# EAGLE design stm32 (EAGLE 8.6.0)
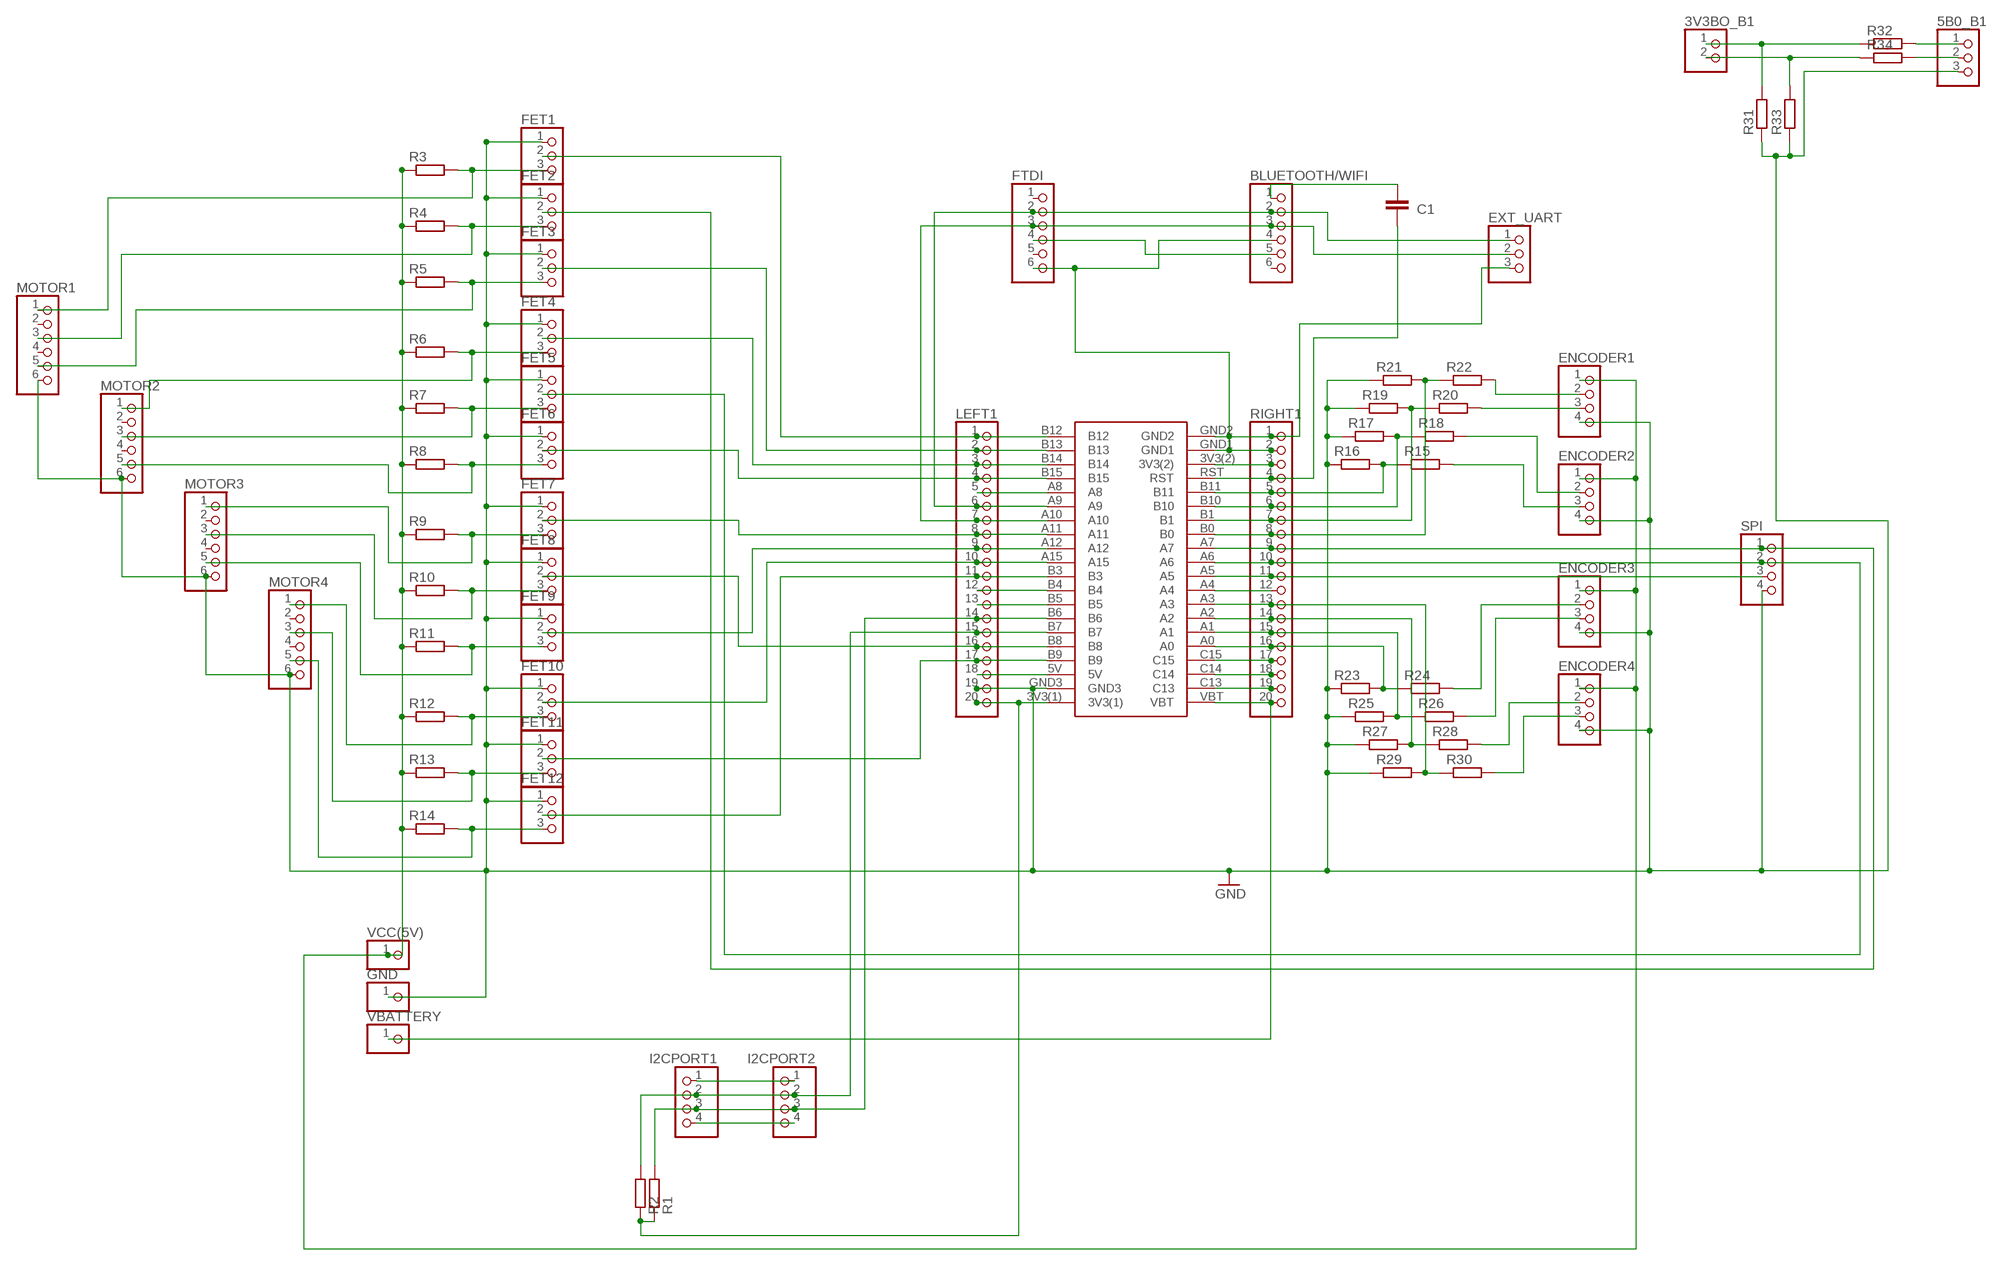
[diagram p0: schematic, sheet 1]

## Parts
3V3BO_B1  PINHD-1X2  [1X02]
5B0_B1  PINHD-1X3  [1X03]
BLUETOOTH/WIFI  PINHD-1X6  [1X06]
C1  C-EU025-030X050  [C025-030X050]
ENCODER1  PINHD-1X4  [1X04]
ENCODER2  PINHD-1X4  [1X04]
ENCODER3  PINHD-1X4  [1X04]
ENCODER4  PINHD-1X4  [1X04]
EXT_UART  PINHD-1X3  [1X03]
FET1  PINHD-1X3  [1X03]
FET2  PINHD-1X3  [1X03]
FET3  PINHD-1X3  [1X03]
FET4  PINHD-1X3  [1X03]
FET5  PINHD-1X3  [1X03]
FET6  PINHD-1X3  [1X03]
FET7  PINHD-1X3  [1X03]
FET8  PINHD-1X3  [1X03]
FET9  PINHD-1X3  [1X03]
FET10  PINHD-1X3  [1X03]
FET11  PINHD-1X3  [1X03]
FET12  PINHD-1X3  [1X03]
FTDI  PINHD-1X6  [1X06]
GND  PINHD-1X1  [1X01]
I2CPORT1  PINHD-1X4  [1X04]
I2CPORT2  PINHD-1X4  [1X04]
LEFT1  PINHD-1X20  [1X20]
MOTOR1  PINHD-1X6  [1X06]
MOTOR2  PINHD-1X6  [1X06]
MOTOR3  PINHD-1X6  [1X06]
MOTOR4  PINHD-1X6  [1X06]
R1  R-EU_0204/5  [0204/5]
R2  R-EU_0204/5  [0204/5]
R3  R-EU_0204/5  [0204/5]
R4  R-EU_0204/5  [0204/5]
R5  R-EU_0204/5  [0204/5]
R6  R-EU_0204/5  [0204/5]
R7  R-EU_0204/5  [0204/5]
R8  R-EU_0204/5  [0204/5]
R9  R-EU_0204/5  [0204/5]
R10  R-EU_0204/5  [0204/5]
R11  R-EU_0204/5  [0204/5]
R12  R-EU_0204/5  [0204/5]
R13  R-EU_0204/5  [0204/5]
R14  R-EU_0204/5  [0204/5]
R15  R-EU_0204/5  [0204/5]
R16  R-EU_0204/5  [0204/5]
R17  R-EU_0204/5  [0204/5]
R18  R-EU_0204/5  [0204/5]
R19  R-EU_0204/5  [0204/5]
R20  R-EU_0204/5  [0204/5]
R21  R-EU_0204/5  [0204/5]
R22  R-EU_0204/5  [0204/5]
R23  R-EU_0204/5  [0204/5]
R24  R-EU_0204/5  [0204/5]
R25  R-EU_0204/5  [0204/5]
R26  R-EU_0204/5  [0204/5]
R27  R-EU_0204/5  [0204/5]
R28  R-EU_0204/5  [0204/5]
R29  R-EU_0204/5  [0204/5]
R30  R-EU_0204/5  [0204/5]
R31  R-EU_0204/5  [0204/5]
R32  R-EU_0204/5  [0204/5]
R33  R-EU_0204/5  [0204/5]
R34  R-EU_0204/5  [0204/5]
RIGHT1  PINHD-1X20  [1X20]
SPI  PINHD-1X4  [1X04]
U$1  STM32THROUGH_HOLE  [STM32]
VBATTERY  PINHD-1X1  [1X01]
VCC(5V)  PINHD-1X1  [1X01]

## Nets
5V: ENCODER1.1 ENCODER2.1 ENCODER3.1 ENCODER4.1 R3.1 R4.1 R5.1 R6.1 R7.1 R8.1 R9.1 R10.1 R11.1 R12.1 R13.1 R14.1 VCC(5V).1
B0: ENCODER1.2 R22.2
B1: ENCODER1.3 R20.2
GND: 5B0_B1.3 ENCODER1.4 ENCODER2.4 ENCODER3.4 ENCODER4.4 FET1.1 FET2.1 FET3.1 FET4.1 FET5.1 FET6.1 FET7.1 FET8.1 FET9.1 FET10.1 FET11.1 FET12.1 GND.1 LEFT1.19 MOTOR1.6 MOTOR2.6 MOTOR3.6 MOTOR4.6 R16.1 R17.1 R19.1 R21.1 R23.1 R25.1 R27.1 R29.1 R31.1 R33.1 SPI.4 U$1.GND3
N$1: 3V3BO_B1.1 R31.2 R32.1
N$2: FET3.2 LEFT1.2 U$1.B13
N$3: LEFT1.20 R1.1 R2.1 U$1.3V3(1)
N$4: FET4.2 LEFT1.3 U$1.B14
N$5: FET6.2 LEFT1.4 U$1.B15
N$6: LEFT1.5 U$1.A8
N$7: BLUETOOTH/WIFI.2 EXT_UART.1 FTDI.2 LEFT1.6 U$1.A9
N$8: LEFT1.18 U$1.5V
N$9: BLUETOOTH/WIFI.3 EXT_UART.2 FTDI.3 LEFT1.7 U$1.A10
N$10: BLUETOOTH/WIFI.5 FTDI.4
N$11: FET10.2 LEFT1.10 U$1.A15
N$12: FET7.2 LEFT1.8 U$1.A11
N$13: FET9.2 LEFT1.9 U$1.A12
N$14: BLUETOOTH/WIFI.1 C1.2
N$15: FET12.2 LEFT1.11 U$1.B3
N$16: I2CPORT1.2 I2CPORT2.2 LEFT1.15 R2.2 U$1.B7
N$17: FET8.2 LEFT1.16 U$1.B8
N$18: FET11.2 LEFT1.17 U$1.B9
N$19: LEFT1.12 U$1.B4
N$20: BLUETOOTH/WIFI.4 EXT_UART.3 FTDI.6 RIGHT1.1 RIGHT1.2 U$1.GND1 U$1.GND2
N$21: 3V3BO_B1.2 R33.2 R34.1
N$22: RIGHT1.20 U$1.VBT VBATTERY.1
N$23: RIGHT1.19 U$1.C13
N$24: RIGHT1.18 U$1.C14
N$25: RIGHT1.17 U$1.C15
N$26: R23.2 R24.1 RIGHT1.16 U$1.A0
N$27: I2CPORT1.1 I2CPORT2.1
N$28: R25.2 R26.1 RIGHT1.15 U$1.A1
N$29: R27.2 R28.1 RIGHT1.14 U$1.A2
N$30: I2CPORT1.3 I2CPORT2.3 LEFT1.14 R1.2 U$1.B6
N$31: R29.2 R30.1 RIGHT1.13 U$1.A3
N$32: RIGHT1.12 U$1.A4
N$33: RIGHT1.11 SPI.3 U$1.A5
N$34: 5B0_B1.1 R32.2
N$35: FET5.2 RIGHT1.10 SPI.2 U$1.A6
N$36: 5B0_B1.2 R34.2
N$37: R21.2 R22.1 RIGHT1.8 U$1.B0
N$39: R17.2 R18.1 RIGHT1.6 U$1.B10
N$40: I2CPORT1.4 I2CPORT2.4
N$43: RIGHT1.3 U$1.3V3(2)
N$44: C1.1 RIGHT1.4 U$1.RST
N$45: R15.1 R16.2 RIGHT1.5 U$1.B11
N$46: FET1.2 LEFT1.1 U$1.B12
N$47: LEFT1.13 U$1.B5
N$48: FET1.3 MOTOR1.1 R3.2
N$49: FET2.3 MOTOR1.3 R4.2
N$50: FET3.3 MOTOR1.5 R5.2
N$51: FET4.3 MOTOR2.1 R6.2
N$52: FET5.3 MOTOR2.3 R7.2
N$53: FET6.3 MOTOR2.5 R8.2
N$54: FET7.3 MOTOR3.1 R9.2
N$55: FET8.3 MOTOR3.3 R10.2
N$56: FET9.3 MOTOR3.5 R11.2
N$57: FET11.3 MOTOR4.3 R13.2
N$58: FET10.3 MOTOR4.1 R12.2
N$59: FET12.3 MOTOR4.5 R14.2
N$60: FET2.2 RIGHT1.9 SPI.1 U$1.A7
N$63: R19.2 R20.1 RIGHT1.7 U$1.B1
N$65: ENCODER3.2 R24.2
N$66: ENCODER3.3 R26.2
N$67: ENCODER4.2 R28.2
N$68: ENCODER4.3 R30.2
N$73: ENCODER2.2 R18.2
N$74: ENCODER2.3 R15.2
Unconnected: BLUETOOTH/WIFI.6 FTDI.1 FTDI.5 MOTOR1.2 MOTOR1.4 MOTOR2.2 MOTOR2.4 MOTOR3.2 MOTOR3.4 MOTOR4.2 MOTOR4.4

## Library data of the parts
3V3BO_B1 = pinhead:PINHD-1X2: PIN HEADER
5B0_B1 EXT_UART FET1-FET12 = pinhead:PINHD-1X3: PIN HEADER
BLUETOOTH/WIFI FTDI MOTOR1-MOTOR4 = pinhead:PINHD-1X6: PIN HEADER
C1 = resistor:C-EU: CAPACITOR, European symbol
ENCODER1-ENCODER4 I2CPORT1 I2CPORT2 SPI = pinhead:PINHD-1X4: PIN HEADER
GND VBATTERY VCC(5V) = pinhead:PINHD-1X1: PIN HEADER
LEFT1 RIGHT1 = pinhead:PINHD-1X20: PIN HEADER
R1-R34 = resistor:R-EU_: RESISTOR, European symbol
U$1 = stm32:STM32

## Board
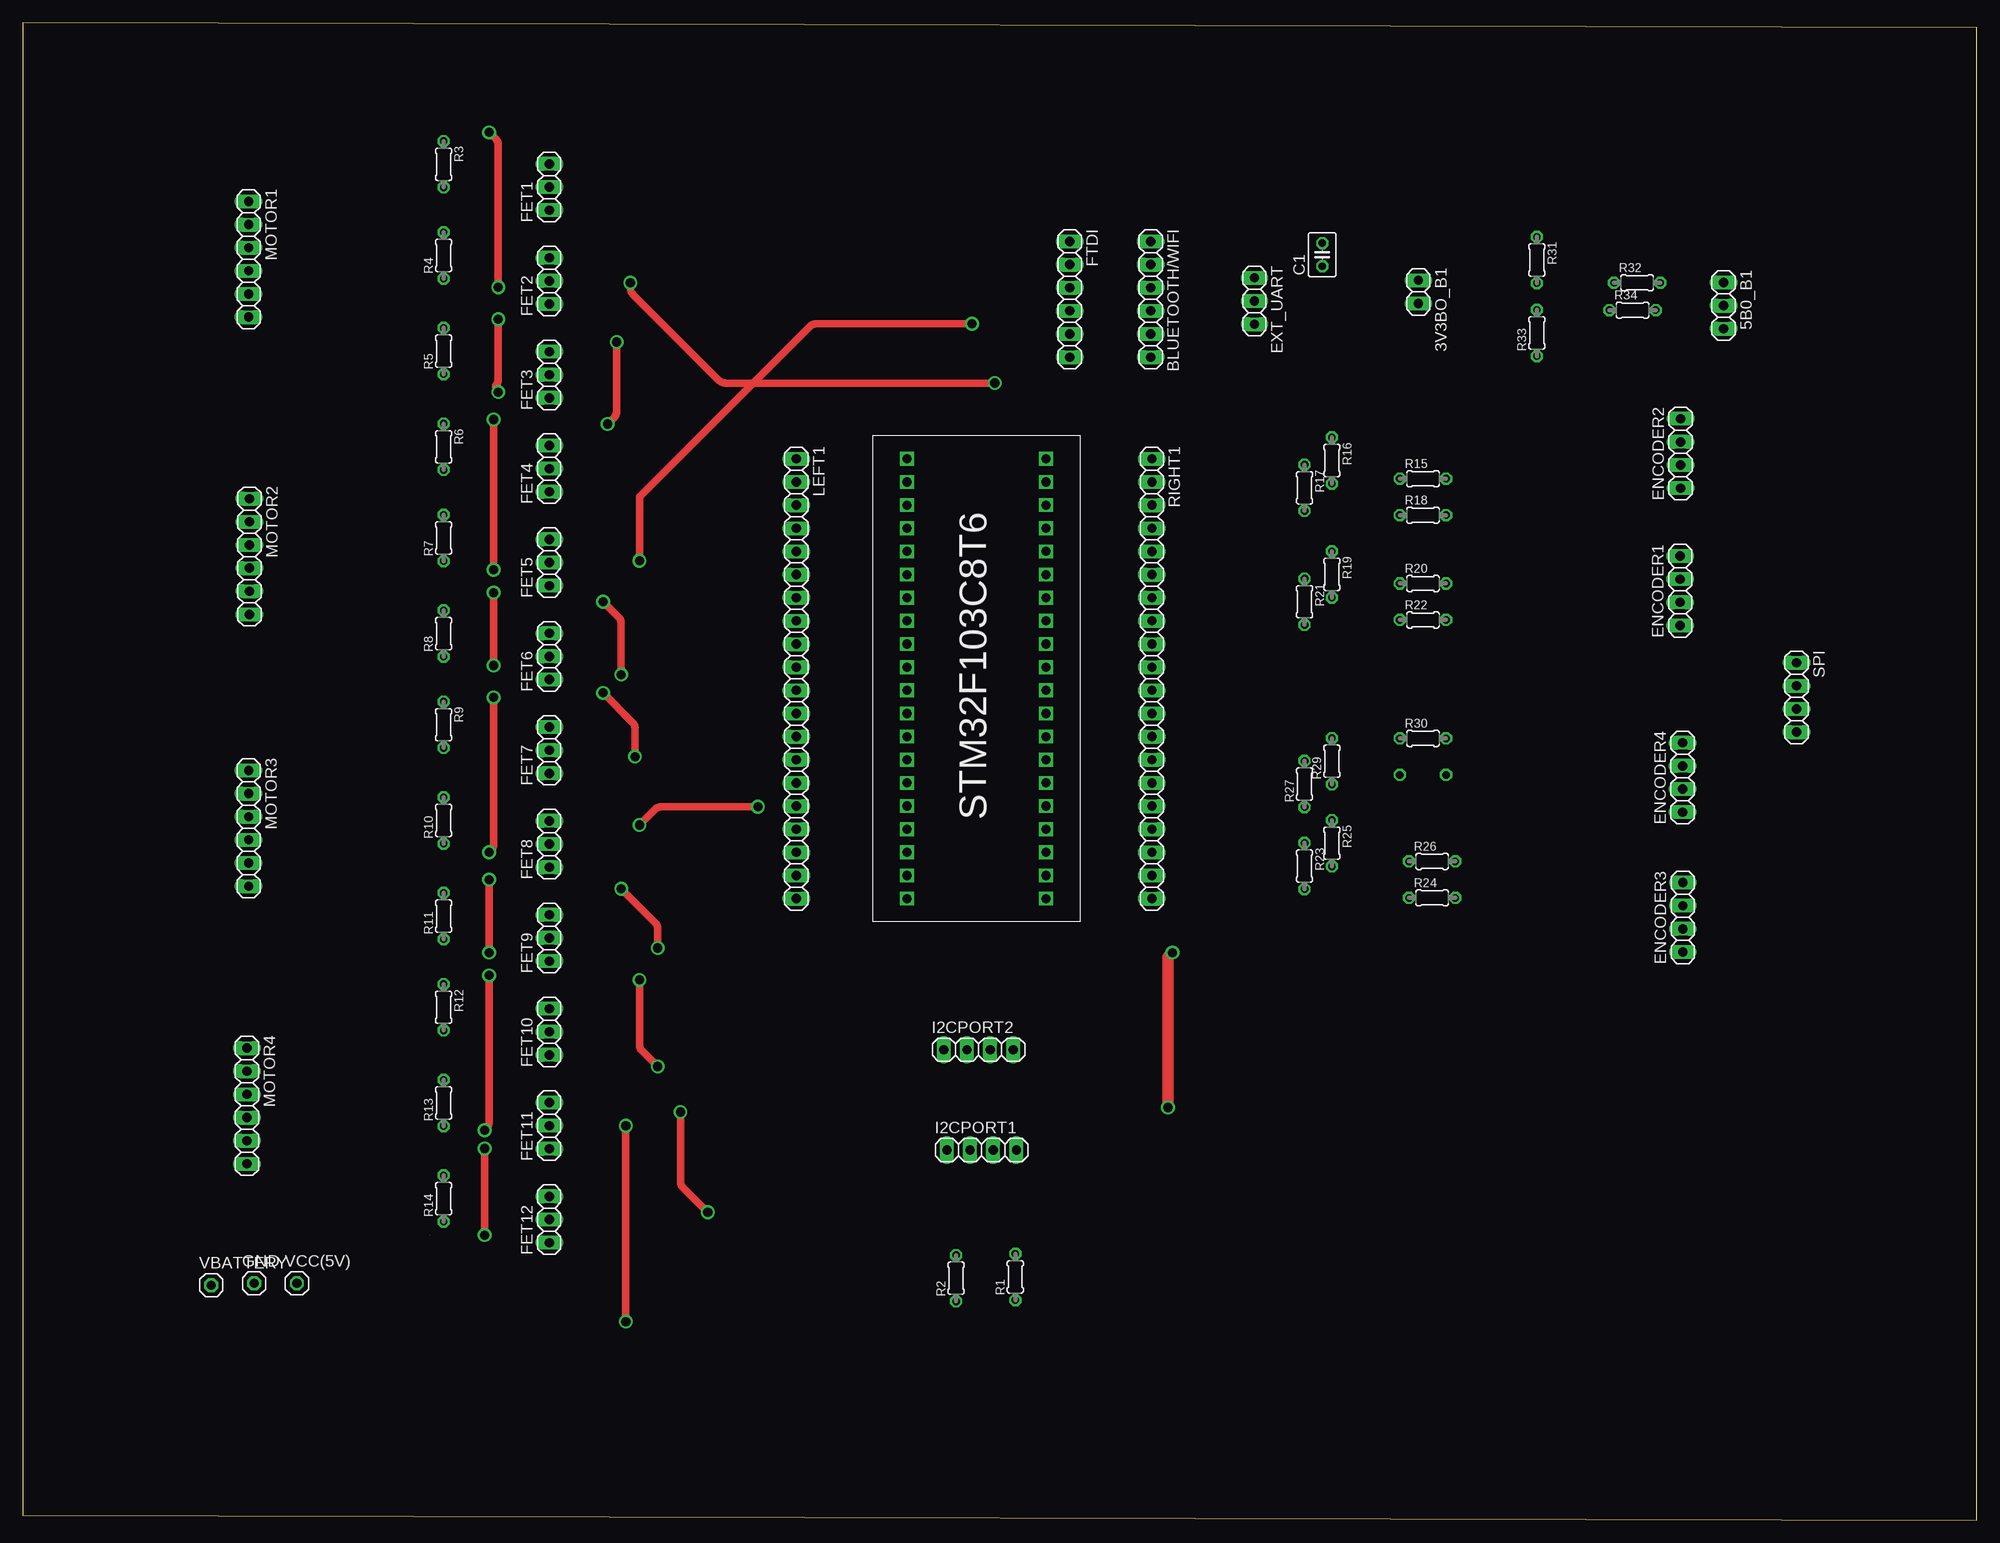
[diagram p1: board, top side]
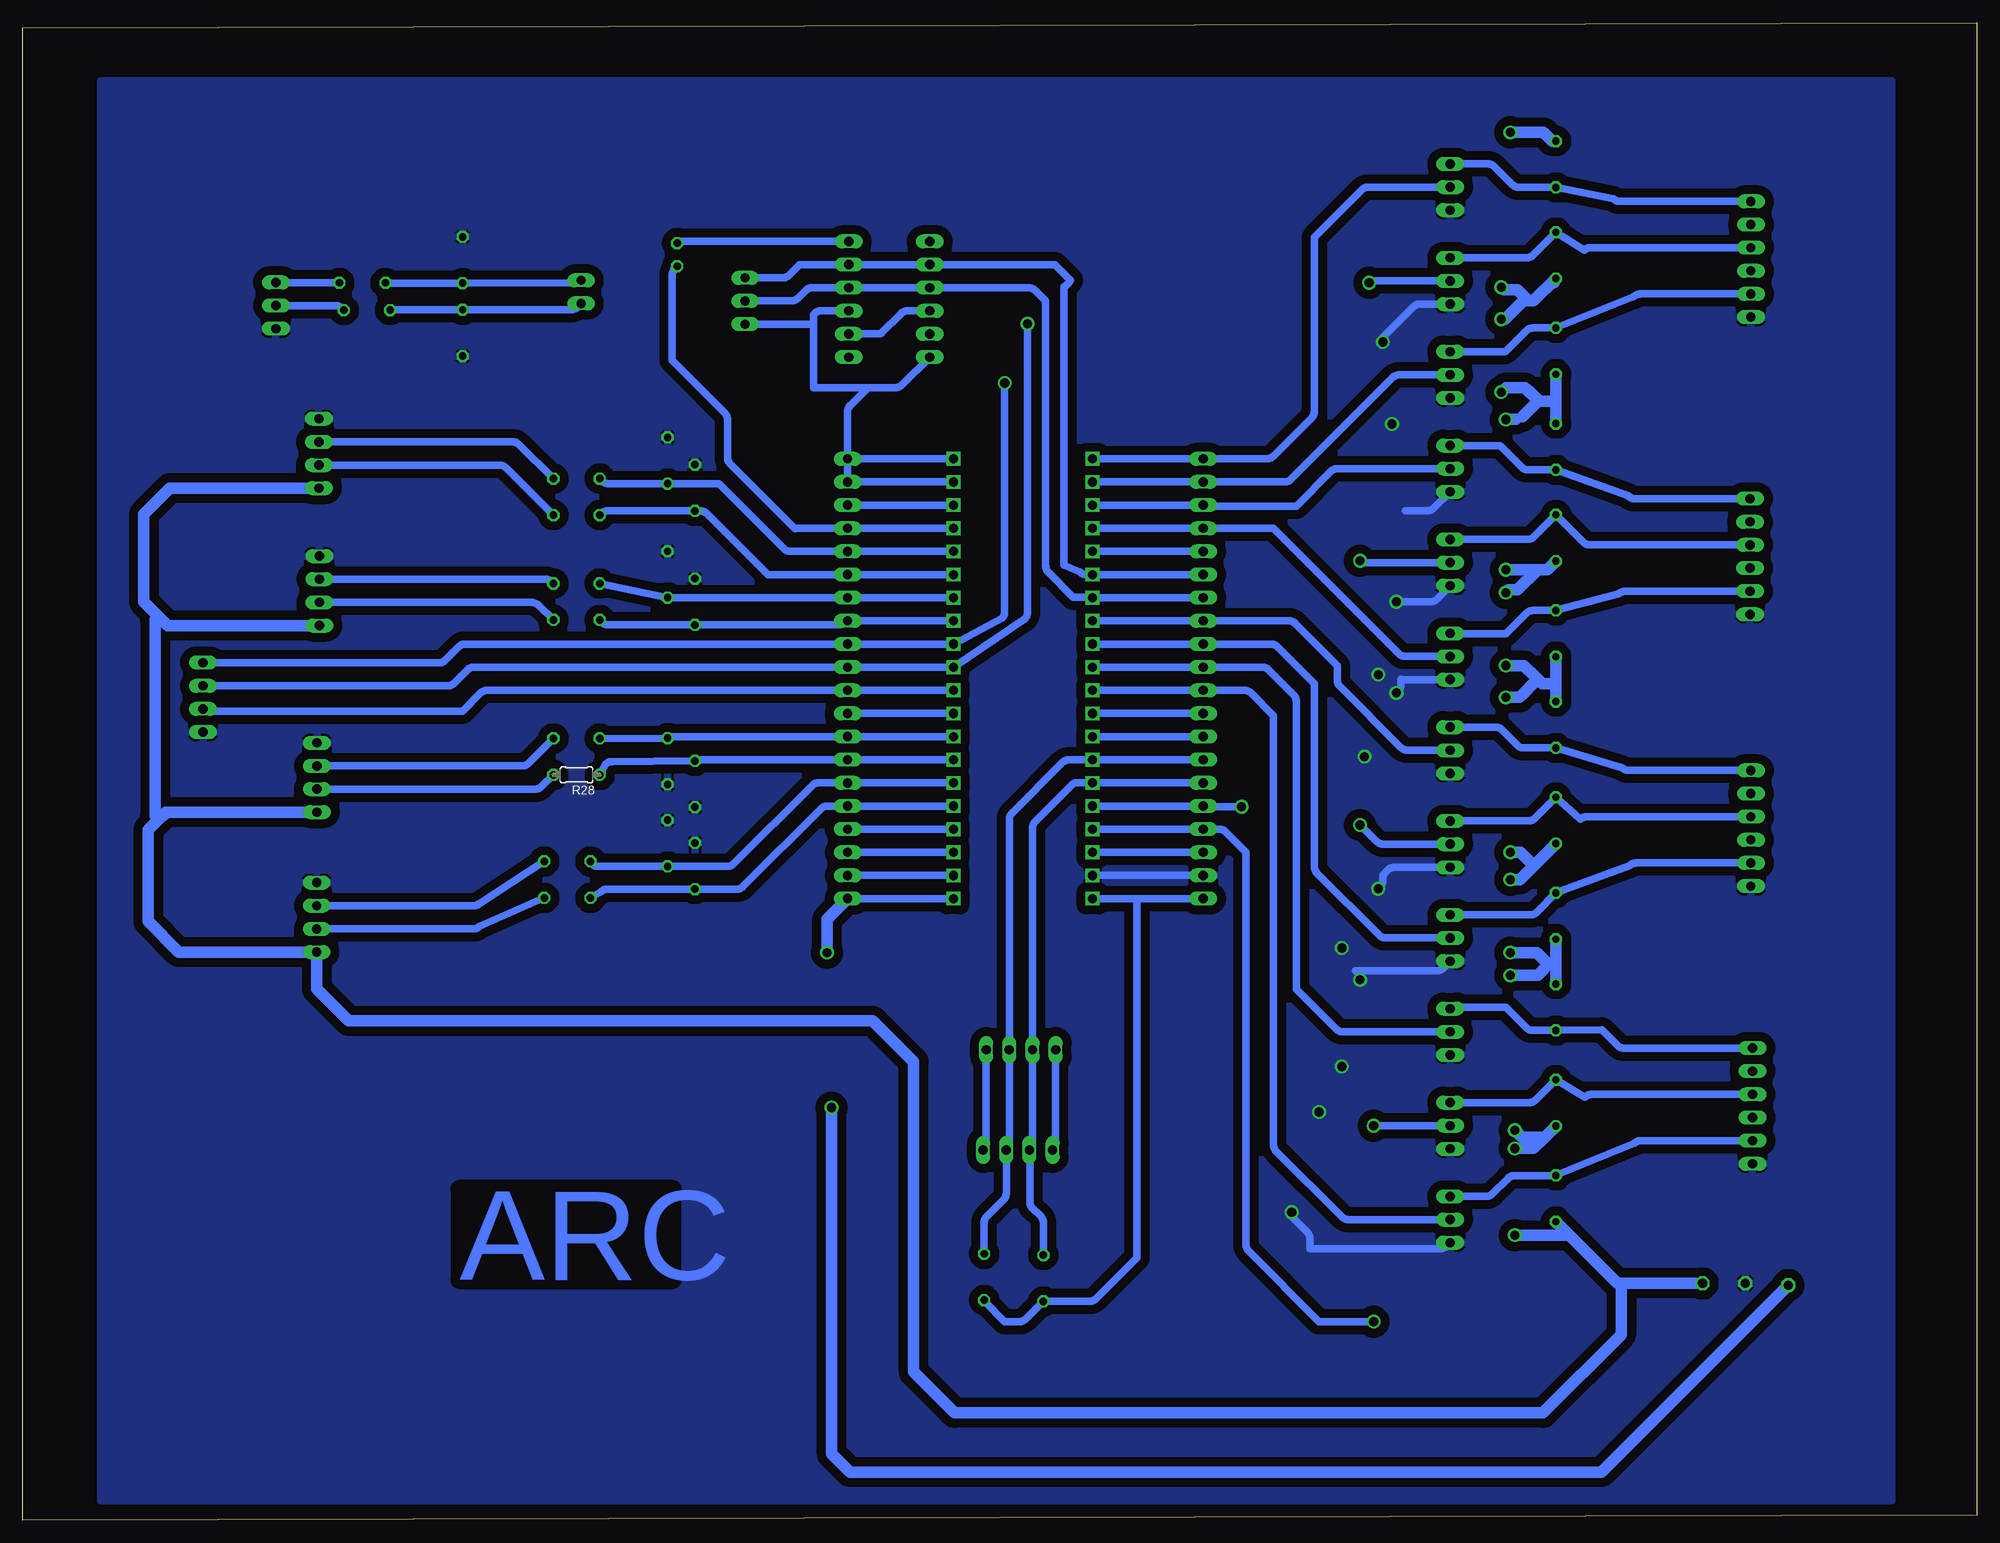
[diagram p2: board, bottom side, seen from below]

Size 214.47 x 164.31 mm. Coordinates in mm from the lower left corner, seen from the top.
Outline: 0,0.54 214.47,0 214.47,163.77 0,164.31 0,0.54
Copper layers (1*16): Top 0.035mm / dielectric 1.5mm / Bottom 0.035mm
Design rules "default": minimum track width 6mil, minimum drill 0.35mm, track to track 6mil, track to pad 6mil, pad to pad 6mil, via to via 6mil, smd to smd 6mil, copper to edge 40mil, drill to drill 6mil, minimum pad ring 10mil, minimum via ring 8mil, stop-mask expansion 4mil, vias tented up to drill 0mil, thermal gap 10mil

### Footprints (pad centres in the part's own frame; a part is rotated, then mirrored left to right if it is on the bottom)
1X02 = drill 1.016 long: 1 -1.27,0; 2 1.27,0
1X03 = drill 1.016 long: 1 -2.54,0; 2 0,0; 3 2.54,0
1X06 = drill 1.016 long: 1 -6.35,0; 2 -3.81,0; 3 -1.27,0; 4 1.27,0; 5 3.81,0; 6 6.35,0
C025-030X050 = drill 0.813 octagon: 1 -1.27,0; 2 1.27,0
1X04 = drill 1.016 long: 1 -3.81,0; 2 -1.27,0; 3 1.27,0; 4 3.81,0
1X01 = drill 1.016 octagon: 1 0,0
1X20 = drill 1.016 long: 1 -24.13,0; 2 -21.59,0; 3 -19.05,0; 4 -16.51,0; 5 -13.97,0; 6 -11.43,0; 7 -8.89,0; 8 -6.35,0; 9 -3.81,0; 10 -1.27,0; 11 1.27,0; 12 3.81,0; 13 6.35,0; 14 8.89,0; 15 11.43,0; 16 13.97,0; 17 16.51,0; 18 19.05,0; 19 21.59,0; 20 24.13,0
0204/5 = drill 0.813 octagon: 1 -2.54,0; 2 2.54,0
STM32 = drill 1 pad 1.27 square: 3V3(1) 2.54,19.05; 3V3(2) 45.72,3.81; 5V 7.62,19.05; A0 12.7,3.81; A1 15.24,3.81; A2 17.78,3.81; A3 20.32,3.81; A4 22.86,3.81; A5 25.4,3.81; A6 27.94,3.81; A7 30.48,3.81; A8 40.64,19.05; A9 38.1,19.05; A10 35.56,19.05; A11 33.02,19.05; A12 30.48,19.05; A15 27.94,19.05; B0 33.02,3.81; B1 35.56,3.81; B3 25.4,19.05; B4 22.86,19.05; B5 20.32,19.05; B6 17.78,19.05; B7 15.24,19.05; B8 12.7,19.05; B9 10.16,19.05; B10 38.1,3.81; B11 40.64,3.81; B12 50.8,19.05; B13 48.26,19.05; B14 45.72,19.05; B15 43.18,19.05; C13 5.08,3.81; C14 7.62,3.81; C15 10.16,3.81; GND1 48.26,3.81; GND2 50.8,3.81; GND3 5.08,19.05; RST 43.18,3.81; VBT 2.54,3.81

### Placement (x,y rotation side)
3V3BO_B1  153.19,134.78 270 top
5B0_B1  186.69,133.28 270 top
BLUETOOTH/WIFI  123.8,133.97 270 top
C1  142.63,138.86 90 top
ENCODER1  181.92,101.98 90 top
ENCODER2  181.97,117.05 90 top
ENCODER3  182.21,66.15 90 top
ENCODER4  182.18,81.49 90 top
EXT_UART  135.19,133.78 270 top
FET1  57.79,146.28 90 top
FET2  57.79,135.98 90 top
FET3  57.79,125.68 90 top
FET4  57.79,115.38 90 top
FET5  57.79,105.08 90 top
FET6  57.79,94.78 90 top
FET7  57.79,84.48 90 top
FET8  57.79,74.18 90 top
FET9  57.79,63.88 90 top
FET10  57.79,53.58 90 top
FET11  57.79,43.28 90 top
FET12  57.79,32.98 90 top
FTDI  114.91,133.97 270 top
GND  25.39,25.98 0 top
I2CPORT1  105.25,40.62 0 top
I2CPORT2  104.91,51.62 0 top
LEFT1  84.91,92.33 270 top
MOTOR1  24.79,138.36 270 top
MOTOR2  24.88,105.74 270 top
MOTOR3  24.79,75.92 270 top
MOTOR4  24.61,45.45 270 top
R1  108.94,26.69 90 top
R2  102.44,26.55 90 top
R3  46.19,148.78 270 top
R4  46.19,138.78 90 top
R5  46.19,128.28 90 top
R6  46.19,117.78 270 top
R7  46.19,107.78 90 top
R8  46.19,97.28 90 top
R9  46.19,87.28 270 top
R10  46.19,76.78 90 top
R11  46.19,66.28 90 top
R12  46.19,56.28 270 top
R13  46.19,45.78 90 top
R14  46.19,35.28 90 top
R15  153.69,114.28 0 top
R16  143.69,116.28 270 top
R17  140.69,113.28 270 top
R18  153.69,110.28 0 top
R19  143.69,103.78 270 top
R20  153.69,102.78 0 top
R21  140.69,100.78 270 top
R22  153.69,98.78 0 top
R23  140.69,71.78 270 top
R24  154.69,68.28 0 top
R25  143.69,74.28 270 top
R26  154.69,72.28 0 top
R27  140.69,80.78 90 top
R28  153.69,81.78 180 bottom
R29  143.69,83.28 90 top
R30  153.69,85.78 0 top
R31  166.19,138.28 270 top
R32  177.19,135.78 0 top
R33  166.19,130.28 90 top
R34  176.69,132.78 0 top
RIGHT1  123.93,92.33 270 top
SPI  194.69,90.28 270 top
U$1  116.12,65.66 90 top
VBATTERY  20.69,25.78 0 top
VCC(5V)  30.09,25.98 0 top

### Tracks (layer width: path | path; a pad name or v marks a point on that pad's centre or on a via)
5V  (via drill 1 pad 1.3)  (1 unrouted)
  Top 0.813: v50.69,31.28 v50.69,40.78 | v50.69,42.78 50.9,42.99 arc45 51.19,43.69 v51.19,59.78 | v51.19,62.28 v51.19,70.28 | v51.19,73.28 51.4,73.49 arc45 51.69,74.19 v51.69,90.28 | v51.69,101.78 v51.69,93.78 | v51.69,104.28 v51.69,120.78 | v52.19,123.78 51.9,124.49 arc45 52.19,125.19 v52.19,131.78 | v52.19,135.28 52.19,150.87 arc45 51.9,151.57 v51.19,152.28
  Bottom 0.813: VCC(5V).1 39.02,25.98 | 39.02,25.98 arc45 39.72,26.27 44.71,31.26 | R5.1 46.19,122.78 | 46.19,122.78 R6.1 | ENCODER1.1 198.17,98.17 arc45 198.87,98.46 199.94,99.53 | 199.94,99.53 201.19,100.78 | 201.19,110.37 201.19,110.28 | ENCODER4.1 197.88,77.68 arc-45 198.58,77.39 200.13,76.2 | 200.13,76.2 200.69,75.78 | 199.94,99.53 199.94,98.78 | 199.94,77.28 199.94,76.67 arc45 200.13,76.2 | v50.69,40.78 49.06,40.78 arc-45 48.36,41.07 47.42,42.01 | 47.48,60.49 arc45 46.78,60.78 | 46.78,60.78 46.19,60.78 | 46.19,60.78 R12.1 | R11.1 46.19,60.78 | 46.78,60.78 47.23,61.24 | R8.1 46.19,91.78 | 46.19,91.78 R9.1 | 46.19,91.78 47.28,91.78 | 47.28,91.78 48.28,91.78 arc-45 48.98,91.49 49.94,90.53 50.19,90.28 | v51.19,70.28 50.56,70.28 arc-45 49.86,70.57 48.42,72.01 R10.1 | R7.1 46.86,104.57 arc45 47.56,104.28 48.19,104.28 | 48.44,92.53 47.98,92.07 arc-45 47.28,91.78 | 50.6,120.78 arc-45 49.9,121.07 | 48.19,122.78 47.69,122.78 | 47.69,122.78 46.69,122.78 46.19,122.78 | 47.69,122.78 48.9,123.99 arc-45 49.6,124.28 | 49.78,133.78 49.19,133.78 | 49.19,133.78 48.19,134.28 46.98,135.49 arc-45 46.19,135.69 R4.1 | 49.19,133.78 49.44,134.03 | 39.02,25.98 39.02,25.28
  Bottom 1.27: VCC(5V).1 39.43,25.98 44.71,31.26 R14.1 | v50.69,31.28 44.73,31.28 | 39.02,25.28 39.02,20.37 47.6,11.78 112.19,11.78 116.69,16.28 116.69,50.28 121.19,54.78 178.69,54.78 182.21,58.3 ENCODER3.1 197.34,62.34 200.69,65.69 200.69,75.78 198.79,77.68 ENCODER4.1 | ENCODER1.1 198.58,98.17 201.19,100.78 201.19,110.28 | ENCODER2.1 198.32,113.24 201.19,110.37 | 199.94,98.78 199.94,77.28 | R13.1 47.42,42.01 | 47.42,42.01 48.65,40.78 v50.69,40.78 | v50.69,42.78 49.92,42.01 47.42,42.01 | 47.23,61.24 48.28,62.28 v51.19,62.28 | v51.19,59.78 48.19,59.78 47.48,60.49 | R10.1 50.15,70.28 v51.19,70.28 | 48.42,72.01 48.83,72.01 50.1,73.28 v51.19,73.28 | R11.1 R12.1 | R8.1 R9.1 | 46.19,91.78 47.69,91.78 48.44,92.53 | 48.44,92.53 49.69,93.78 v51.69,93.78 | v51.69,90.28 50.19,90.28 | 49.94,90.53 48.44,92.03 48.44,92.53 | R7.1 47.15,104.28 48.19,104.28 | 48.19,104.28 v51.69,104.28 | v51.69,101.78 51.4,102.07 50.4,102.07 48.19,104.28 | R6.1 R5.1 | 46.69,122.78 48.19,122.78 | 48.19,122.78 49.9,121.07 | v51.69,120.78 50.6,120.78 | 48.19,122.78 48.19,122.87 49.6,124.28 51.69,124.28 v52.19,123.78 | R4.1 48.65,133.78 49.78,133.78 51.78,131.78 v52.19,131.78 | 49.44,134.03 50.4,134.99 51.9,134.99 v52.19,135.28 | R3.1 46.6,151.32 47.56,152.28 v51.19,152.28
B0
  Bottom 0.813: ENCODER1.2 159.07,100.71 arc45 157.87,100.42 R22.2
B1
  Bottom 0.813: R20.2 156.41,102.96 arc-45 157.11,103.25 ENCODER1.3
GND  (via drill 1 pad 1.3)
  Top 0.813: v65.19,129.28 65.19,121.69 arc-45 64.9,120.99 v64.19,120.28 | v75.19,33.78 72.48,36.49 arc-45 72.19,37.19 v72.19,44.78 | v67.69,59.28 67.69,52.19 arc45 67.98,51.49 v69.69,49.78 | v65.69,69.28 69.4,65.57 arc-45 69.69,64.87 v69.69,62.78 | v63.69,90.78 66.9,87.57 arc-45 67.19,86.87 v67.19,83.78 | v63.69,100.78 65.4,99.07 arc-45 65.69,98.37 v65.69,92.78
  Bottom 0.813: LEFT1.19 U$1.GND3 | FET2.1 61.12,133.44 arc-45 61.82,133.15 65.19,129.78 v65.19,129.28 | FET12.1 58.16,30.07 arc45 58.86,29.78 73.19,29.78 73.19,30.87 arc-45 73.48,31.57 75.19,33.28 v75.19,33.78 | FET9.1 58.56,60.57 arc45 59.26,60.28 68.19,60.28 67.98,60.07 arc45 67.69,59.37 v67.69,59.28 | FET8.1 63.92,71.64 arc-45 64.62,71.35 65.19,70.78 65.19,70.19 arc45 65.48,69.49 v65.69,69.28 | FET6.1 63.09,92.24 arc45 63.19,92.28 63.19,91.69 arc45 63.48,90.99 v63.69,90.78 | FET5.1 59.26,101.07 arc45 59.96,100.78 v63.69,100.78 | FET4.1 59.56,111.07 arc45 60.26,110.78 62.69,110.78
  pour Bottom (isolate 1): 9.35,157.97 205.91,157.97 205.91,2.12 9.35,2.12
N$1
  Bottom 0.813: 153.84,135.78 arc-45 3V3BO_B1.1 arc45 153.84,135.78 | 153.84,135.78 165.69,135.74 | 165.69,135.74 R31.2 | R32.1 arc-45 174.56,135.74 165.69,135.74
N$2
  Bottom 0.813: U$1.B13 LEFT1.2 75.96,113.92 arc-45 75.26,114.21 64.08,125.39 arc45 63.38,125.68 FET3.2
N$3
  Bottom 0.813: LEFT1.20 92.19,68.2 | 92.19,68.2 U$1.3V3(1) | R1.1 arc-45 108.86,23.95 106.69,21.78 105.08,21.78 arc-45 104.38,22.07 R2.1 97.37,24.01 arc-45 96.67,24.3 92.19,28.78 92.19,68.2
N$4
  Bottom 0.813: U$1.B14 LEFT1.3 arc-45 84.67,111.28 74.69,111.28 70.88,115.09 arc45 70.18,115.38 FET4.2
N$5
  Bottom 0.813: U$1.B15 LEFT1.4 77.19,108.84 66.66,98.31 63.42,95.07 arc-45 62.72,94.78 FET6.2
N$6
  Bottom 0.813: U$1.A8 LEFT1.5
N$7
  Bottom 0.813: LEFT1.6 U$1.A9 97.76,103.76 arc45 98.46,104.05 100.19,104.78 100.19,135.37 arc-45 99.48,136.07 101.19,137.78 FTDI.2 BLUETOOTH/WIFI.2 129.19,137.78 130.36,136.61 arc45 131.06,136.32 EXT_UART.1
N$8
  Bottom 0.813: LEFT1.18 U$1.5V
N$9
  Bottom 0.813: LEFT1.7 U$1.A10 arc-45 97.22,101.28 99.19,101.28 101.9,103.99 arc45 102.19,104.69 102.19,133.78 103.36,134.95 arc-45 104.06,135.24 FTDI.3 BLUETOOTH/WIFI.3 127.82,135.24 arc-45 128.52,134.95 129.4,134.07 arc45 130.1,133.78 EXT_UART.2
N$10
  Bottom 0.813: FTDI.4 117.36,132.7 arc-45 118.06,132.41 120.19,130.28 arc45 120.48,130.16 BLUETOOTH/WIFI.5
N$11
  Bottom 0.813: LEFT1.10 U$1.A15 | 83.92,93.6 LEFT1.10 | LEFT1.10 78.42,93.6 arc45 77.72,93.31 74.98,90.57 arc45 74.69,89.87 74.69,58.28 70.28,53.87 arc-45 69.58,53.58 FET10.2
N$12
  Bottom 0.813: U$1.A11 LEFT1.8 75.5,98.68 arc45 74.8,98.39 70.19,93.78 70.19,92.19 arc-45 69.9,91.49 63.18,84.77 arc-45 62.48,84.48 FET7.2
N$13
  Bottom 0.813: U$1.A12 LEFT1.9 77.46,96.14 arc45 76.76,95.85 72.69,91.78 72.69,71.69 arc-45 72.4,70.99 65.58,64.17 arc-45 64.88,63.88 FET9.2
N$14
  Bottom 0.813: BLUETOOTH/WIFI.1 142.17,140.32 arc-45 C1.2
N$15
  Bottom 0.813: U$1.B3 LEFT1.11 80.38,91.06 arc45 79.68,90.77 77.19,88.28 77.19,41.19 arc-45 76.9,40.49 69.68,33.27 arc-45 68.98,32.98 FET12.2
N$16
  Bottom 0.813: LEFT1.15 U$1.B7 98.9,80.9 arc-45 99.19,80.78 103.35,76.62 arc-45 103.64,75.92 I2CPORT2.2 103.64,41.37 arc45 103.93,40.67 | 103.93,40.67 I2CPORT1.2 | R2.2 102.44,32.62 arc-45 102.73,33.32 103.69,34.28 arc45 103.93,34.87 103.93,40.67
N$17  (via drill 1 pad 1.3)
  Top 0.813: v67.69,76.28 69.4,77.99 arc-45 70.1,78.28 v80.69,78.28
  Bottom 0.813: U$1.B8 LEFT1.16 arc-45 84.72,78.28 v80.69,78.28 | FET8.2 65.18,74.18 arc45 65.88,74.47 v67.69,76.28
N$18  (via drill 1 pad 1.3)
  Top 0.813: v66.19,43.28 v66.19,21.78
  Bottom 0.813: U$1.B9 LEFT1.17 83.14,75.82 arc45 82.44,75.53 80.19,73.28 80.19,30.19 arc-45 79.9,29.49 72.19,21.78 v66.19,21.78 | FET11.2 v66.19,43.28
N$19
  Bottom 0.813: LEFT1.12 U$1.B4
N$20
  Bottom 0.813: U$1.GND2 RIGHT1.1 | U$1.GND1 RIGHT1.2 RIGHT1.1 | FTDI.6 117.96,124.57 arc45 118.66,124.28 121.69,124.28 | 121.69,124.28 127.69,124.28 127.69,131.28 | 127.69,131.28 127.69,132.28 127.56,132.41 arc45 126.86,132.7 BLUETOOTH/WIFI.4 | RIGHT1.1 123.93,121.63 arc45 123.64,122.33 121.69,124.28 | EXT_UART.3 127.79,131.24 arc-45 127.69,131.28
N$21
  Bottom 0.813: 3V3BO_B1.2 153.59,133.11 arc45 154.29,132.82 R33.2 174.05,132.82 arc-45 R34.1
N$22  (via drill 1 pad 1.3)
  Top 1.27: v126.19,62.28 125.69,61.78 v125.69,45.28
  Bottom 0.813: U$1.VBT RIGHT1.20
  Bottom 1.27: VBATTERY.1 41.19,5.28 123.69,5.28 125.69,7.28 v125.69,45.28 | v126.19,62.28 126.19,65.94 RIGHT1.20
N$23
  Bottom 0.813: U$1.C13 RIGHT1.19
N$24
  Bottom 0.813: RIGHT1.18 U$1.C14
N$25
  Bottom 0.813: U$1.C15 RIGHT1.17
N$26
  Bottom 0.813: U$1.A0 RIGHT1.16 126.16,78.36 arc-45 126.86,78.07 135.4,69.53 arc45 136.1,69.24 R23.2 150.28,69.24 arc-45 150.98,68.95 R24.1
N$27
  Bottom 0.813: I2CPORT2.1 101.1,41.37 arc45 101.39,40.67 I2CPORT1.1
N$28
  Bottom 0.813: U$1.A1 RIGHT1.15 127.16,80.9 arc-45 127.86,80.61 136.44,72.03 arc45 137.14,71.74 R25.2 151.55,71.74 arc45 R26.1
N$29
  Bottom 0.813: U$1.A2 RIGHT1.14 140.71,83.44 arc-45 R27.2 149.78,83.24 arc-45 150.48,82.95 R28.1
N$30
  Bottom 0.813: LEFT1.14 U$1.B6 99.62,83.44 arc-45 100.32,83.15 105.89,77.58 arc-45 106.18,76.88 I2CPORT2.3 106.18,41.37 arc45 106.47,40.67 I2CPORT1.3 106.52,35.86 arc45 106.81,35.16 108.69,33.28 arc-45 108.94,32.68 R1.2
N$31
  Bottom 0.813: U$1.A3 RIGHT1.13 143.61,85.98 arc-45 R29.2 151.05,85.74 arc45 R30.1
N$32
  Bottom 0.813: RIGHT1.12 U$1.A4
N$33
  Bottom 0.813: U$1.A5 RIGHT1.11 163.5,91.06 arc-45 164.2,90.77 166.19,88.78 194.13,88.78 arc45 SPI.3
N$34
  Bottom 0.813: R32.2 186.59,135.78 arc45 5B0_B1.1
N$35  (via drill 1 pad 1.3)
  Top 0.813: v104.19,131.28 87.1,131.28 arc45 86.4,130.99 67.69,112.28 v67.69,105.28
  Bottom 0.813: SPI.2 167.83,91.55 arc-45 167.13,91.84 165.66,93.31 arc45 164.96,93.6 RIGHT1.10 U$1.A6 104.48,98.93 arc-45 104.19,99.63 v104.19,131.28 | FET5.2 67.21,105.08 arc45 v67.69,105.28
N$36
  Bottom 0.813: 5B0_B1.2 180.14,133.28 arc45 179.44,132.99 R34.2
N$37
  Bottom 0.813: U$1.B0 RIGHT1.8 124.04,98.57 arc45 124.74,98.28 140.59,98.28 arc-45 R21.2 150.2,98.24 arc45 150.9,98.53 R22.1
N$39
  Bottom 0.813: U$1.B10 RIGHT1.6 132.69,103.76 139.38,110.45 arc-45 140.08,110.74 R17.2 150.28,110.74 arc-45 150.98,110.45 R18.1
N$40
  Bottom 0.813: I2CPORT2.4 108.72,41.37 arc45 109.01,40.67 I2CPORT1.4
N$43
  Bottom 0.813: U$1.3V3(2) RIGHT1.3
N$44
  Bottom 0.813: U$1.RST RIGHT1.4 129.55,108.84 arc-45 129.69,108.78 136.84,115.93 arc45 137.13,116.63 137.13,120.81 arc-45 137.42,121.51 143.19,127.28 143.19,136.62 arc45 142.9,137.32 C1.1
N$45
  Bottom 0.813: U$1.B11 RIGHT1.5 130.21,106.3 arc45 130.92,106.59 138.06,113.74 R16.2 150.2,113.74 arc45 150.9,114.03 R15.1
N$46
  Bottom 0.813: U$1.B12 LEFT1.1 77.92,116.46 arc-45 77.22,116.75 72.98,120.99 arc-45 72.69,121.69 72.69,140.78 67.48,145.99 arc45 66.78,146.28 FET1.2
N$47
  Bottom 0.813: LEFT1.13 U$1.B5
N$48
  Bottom 0.813: MOTOR1.1 39.17,144.71 arc45 39.87,145 R3.2 50.24,146.24 arc45 50.94,146.53 52.94,148.53 arc-45 53.64,148.82 FET1.3
N$49
  Bottom 0.813: MOTOR1.3 42.39,139.63 arc-45 43.09,139.34 R4.2 48.7,138.81 arc45 49.4,138.52 FET2.3
N$50
  Bottom 0.813: MOTOR1.5 36.97,134.55 arc-45 37.67,134.26 R5.2 48.74,130.82 arc-45 49.44,130.53 51.69,128.28 arc45 51.83,128.22 FET3.3
N$51
  Bottom 0.813: MOTOR2.1 37.55,112.09 arc45 38.25,112.38 R6.2 49.24,115.24 arc45 49.94,115.53 52.19,117.78 arc-45 52.53,117.92 FET4.3
N$52
  Bottom 0.813: MOTOR2.3 42.47,107.01 arc45 43.17,107.3 R7.2 48.6,107.91 arc45 49.3,107.62 FET5.3
N$53
  Bottom 0.813: MOTOR2.5 38.59,101.93 arc-45 39.29,101.64 R8.2 48.74,99.82 arc-45 49.44,99.53 51.69,97.28 57.69,97.28 arc45 FET6.3
N$54
  Bottom 0.813: MOTOR3.1 38.23,82.27 arc45 38.93,82.56 R9.2 49.74,84.74 arc45 50.44,85.03 52.19,86.78 arc-45 52.77,87.02 FET7.3
N$55
  Bottom 0.813: MOTOR3.3 42.83,77.19 arc-45 43.53,76.9 R10.2 48.5,77.01 arc45 49.2,76.72 FET8.3
N$56
  Bottom 0.813: MOTOR3.5 37.41,72.11 arc-45 38.11,71.82 R11.2 48.3,66.71 arc45 49,66.42 FET9.3
N$57
  Bottom 0.813: MOTOR4.3 42.3,46.72 arc-45 43,46.43 R13.2 48.4,46.11 arc45 49.1,45.82 FET11.3
N$58
  Bottom 0.813: MOTOR4.1 38.76,51.8 arc45 39.46,52.09 41.17,53.8 R12.2 48.74,53.74 arc45 49.44,54.03 51.69,56.28 57.4,56.28 arc-45 FET10.3
N$59
  Bottom 0.813: MOTOR4.5 36.88,41.64 arc-45 37.58,41.35 R14.2 arc45 46.29,37.78 50.78,37.78 arc-45 51.48,37.49 53.16,35.81 arc45 53.86,35.52 FET12.3
N$60  (via drill 1 pad 1.3)
  Top 0.813: v106.69,124.78 77.1,124.78 arc-45 76.4,125.07 66.98,134.49 arc-45 66.69,135.19 v66.69,135.78
  Bottom 0.813: SPI.1 168.65,94.09 arc-45 168.19,94.28 166.62,95.85 arc45 165.92,96.14 RIGHT1.9 U$1.A7 106.98,98.97 arc-45 106.69,99.67 v106.69,124.78 | v66.69,135.78 arc45 66.21,135.98 FET2.2
N$63
  Bottom 0.813: U$1.B1 RIGHT1.7 143.64,101.22 arc45 R19.2 151.05,102.74 arc45 R20.1
N$65
  Bottom 0.813: R24.2 164.34,65.17 arc45 165.04,64.88 ENCODER3.2
N$66
  Bottom 0.813: R26.2 164.3,67.71 arc45 165,67.42 ENCODER3.3
N$67
  Bottom 0.813: R28.2 157.5,80.51 arc45 158.2,80.22 ENCODER4.2
N$68
  Bottom 0.813: R30.2 158.96,83.05 arc45 159.66,82.76 ENCODER4.3
N$73
  Bottom 0.813: R18.2 161.44,115.49 arc-45 162.14,115.78 ENCODER2.2
N$74
  Bottom 0.813: R15.2 159.98,118.03 arc-45 160.68,118.32 ENCODER2.3

### Text on the board
Bottom: ARC